# EAGLE schematic leptetomotor (EAGLE 6.0)
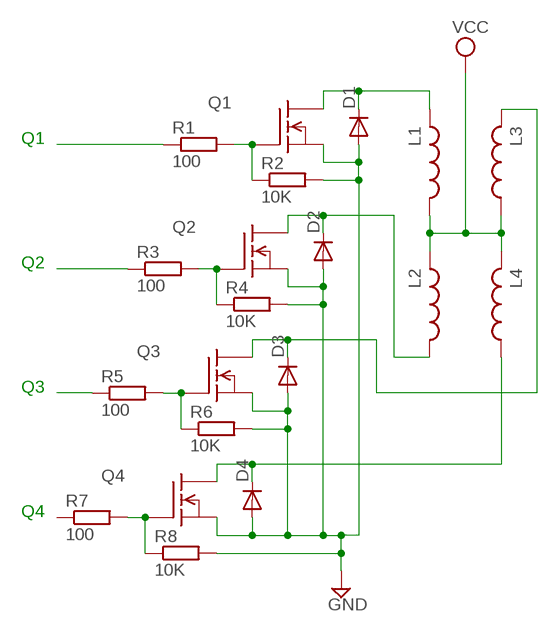
[diagram p0: schematic, sheet 1]

## Parts
D1  1N4004  [DO41-10]
D2  1N4004  [DO41-10]
D3  1N4004  [DO41-10]
D4  1N4004  [DO41-10]
L1  L-US0204/5  [0204/5]
L2  L-US0204/5  [0204/5]
L3  L-US0204/5  [0204/5]
L4  L-US0204/5  [0204/5]
Q1  BUZ10  [TO220]
Q2  BUZ10  [TO220]
Q3  BUZ10  [TO220]
Q4  BUZ10  [TO220]
R1  100  R-EU_VMTB60  [VMTB60]
R2  10K  R-EU_VMTB60  [VMTB60]
R3  100  R-EU_VMTB60  [VMTB60]
R4  10K  R-EU_VMTB60  [VMTB60]
R5  100  R-EU_VMTB60  [VMTB60]
R6  10K  R-EU_VMTB60  [VMTB60]
R7  100  R-EU_VMTB60  [VMTB60]
R8  10K  R-EU_VMTB60  [VMTB60]

## Nets
GND: D1.A D2.A D3.A D4.A Q1.3(S) Q2.3(S) Q3.3(S) Q4.3(S) R2.2 R4.2 R6.2 R8.2
N$1: D1.C L1.2 Q1.2(D)
N$2: Q1.1(G) R1.2 R2.1
N$3: D2.C L2.1 Q2.2(D)
N$4: D4.C L4.1 Q4.2(D)
N$5: Q3.1(G) R5.2 R6.1
N$6: Q4.1(G) R7.2 R8.1
N$7: Q2.1(G) R3.2 R4.1
N$8: D3.C L3.2 Q3.2(D)
N$9: R5.1
N$10: R1.1
N$11: R3.1
VCC: L1.1 L2.2 L3.1 L4.2
Unconnected: R7.1

## Notes on the sheet
- Q1
- Q2
- Q3
- Q4

## Library data of the parts
D1-D4 = diode:1N4004: DIODE general purpose rectifier, 1 A
L1-L4 = rcl:L-US: INDUCTOR, American symbol
Q1-Q4 = transistor-fet:BUZ10: N-Channel Enhancement MOSFET 50V; 20A; 0,080Ohm
R1-R8 = rcl:R-EU_: RESISTOR, European symbol